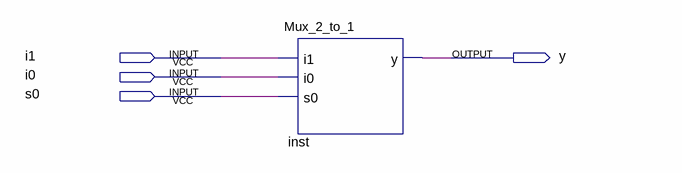
[diagram p0: schematic sheet]
// Quartus schematic Block2.bdf as structural Verilog: 1 symbols, 4 pins
module Block2 (
  input  i1,
  input  i0,
  input  s0,
  output y
);

  Mux_2_to_1 inst (.i1(i1), .i0(i0), .s0(s0), .y(y));
endmodule
